# Altium project steering_wheel_unit.PrjPcb (part 2 of 2)

## Sheet io.SchDoc
size A2; SheetNumber: 2; SheetTotal: 4
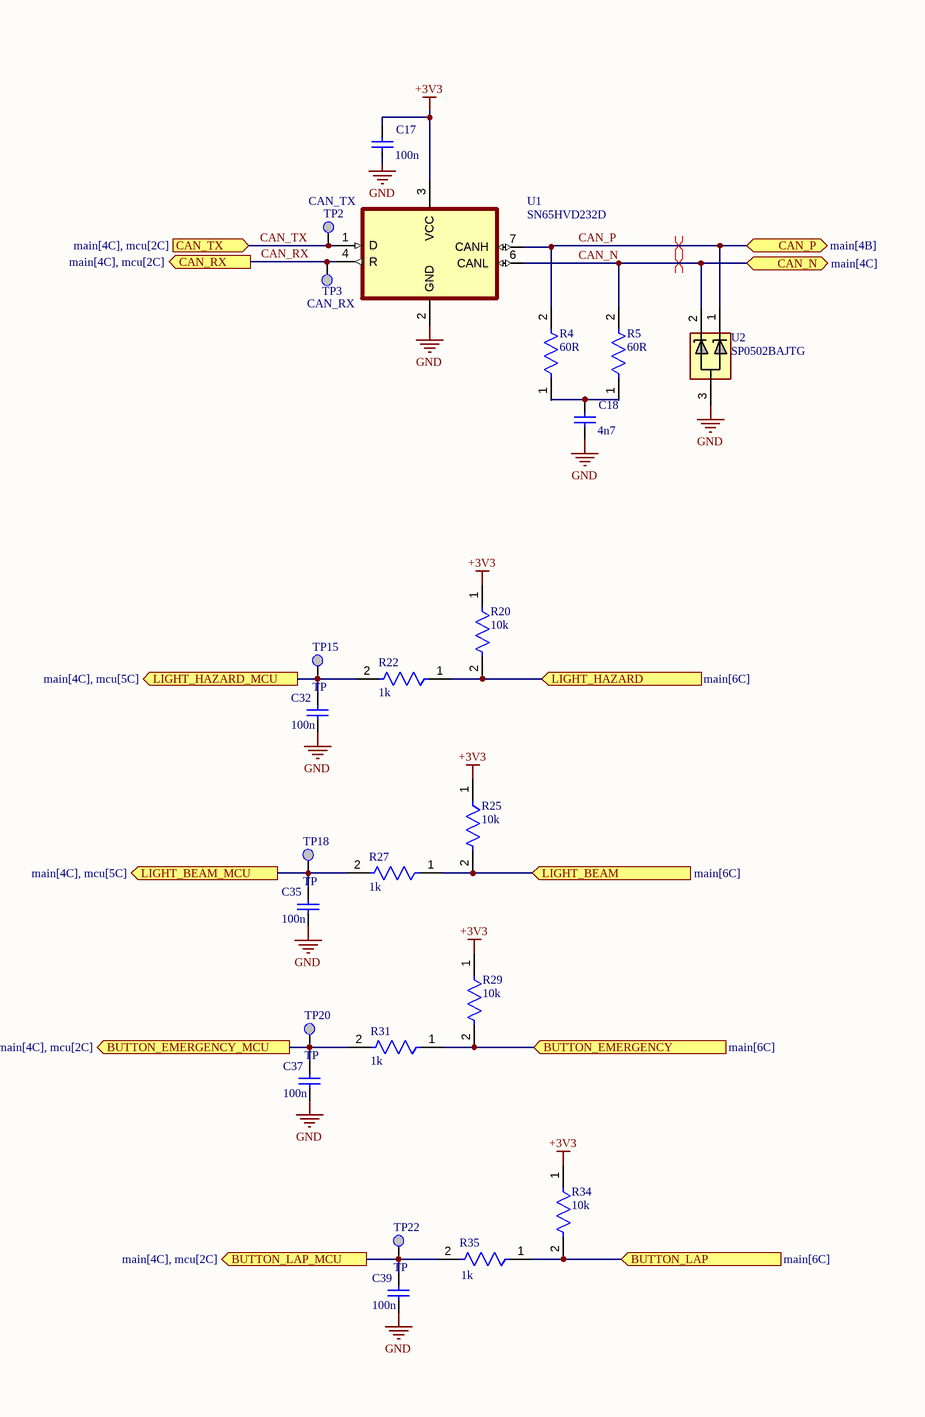
[diagram p2: io.SchDoc, left]
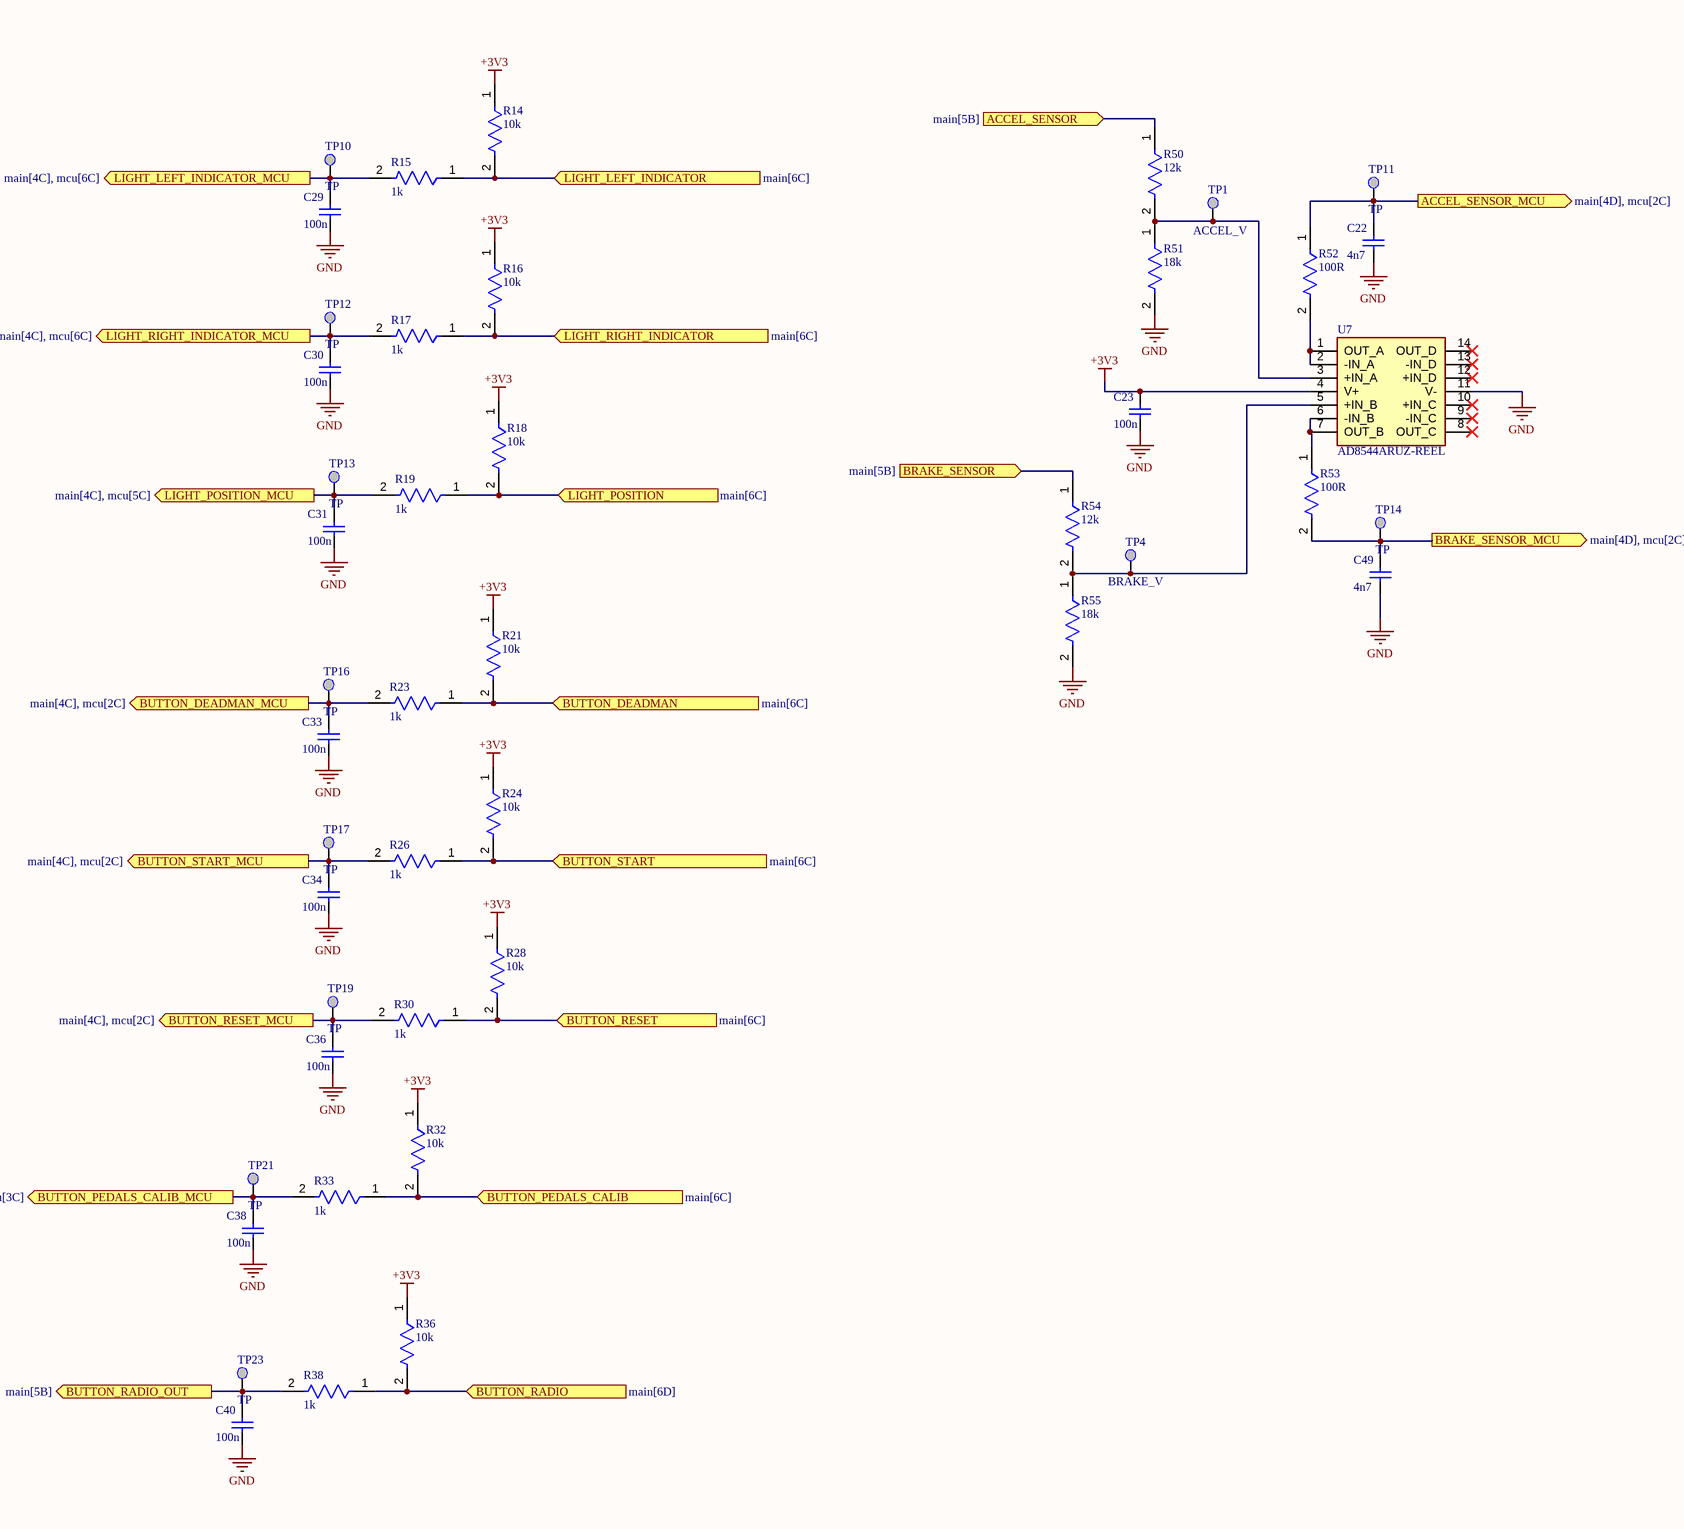
[diagram p3: io.SchDoc, right]

### Parts
C17  100n  [CAPC1206(3216)150_L]
C18  4n7  [CAPC1206(3216)150_L]
C22  4n7  [CAPC1206(3216)150_L]
C23  100n  [CAPC1206(3216)150_L]
C29  100n  [CAPC1206(3216)150_L]
C30  100n  [CAPC1206(3216)150_L]
C31  100n  [CAPC1206(3216)150_L]
C32  100n  [CAPC1206(3216)150_L]
C33  100n  [CAPC1206(3216)150_L]
C34  100n  [CAPC1206(3216)150_L]
C35  100n  [CAPC1206(3216)150_L]
C36  100n  [CAPC1206(3216)150_L]
C37  100n  [CAPC1206(3216)150_L]
C38  100n  [CAPC1206(3216)150_L]
C39  100n  [CAPC1206(3216)150_L]
C40  100n  [CAPC1206(3216)150_L]
C49  4n7  [CAPC1206(3216)150_L]
R4  60R  [FP-RK73H2B-MFG]
R5  60R  [FP-RK73H2B-MFG]
R14  10k  [FP-RK73H2B-MFG]
R15  1k  [FP-RK73H2B-MFG]
R16  10k  [FP-RK73H2B-MFG]
R17  1k  [FP-RK73H2B-MFG]
R18  10k  [FP-RK73H2B-MFG]
R19  1k  [FP-RK73H2B-MFG]
R20  10k  [FP-RK73H2B-MFG]
R21  10k  [FP-RK73H2B-MFG]
R22  1k  [FP-RK73H2B-MFG]
R23  1k  [FP-RK73H2B-MFG]
R24  10k  [FP-RK73H2B-MFG]
R25  10k  [FP-RK73H2B-MFG]
R26  1k  [FP-RK73H2B-MFG]
R27  1k  [FP-RK73H2B-MFG]
R28  10k  [FP-RK73H2B-MFG]
R29  10k  [FP-RK73H2B-MFG]
R30  1k  [FP-RK73H2B-MFG]
R31  1k  [FP-RK73H2B-MFG]
R32  10k  [FP-RK73H2B-MFG]
R33  1k  [FP-RK73H2B-MFG]
R34  10k  [FP-RK73H2B-MFG]
R35  1k  [FP-RK73H2B-MFG]
R36  10k  [FP-RK73H2B-MFG]
R38  1k  [FP-RK73H2B-MFG]
R50  12k  [FP-RK73H2B-MFG]
R51  18k  [FP-RK73H2B-MFG]
R52  100R  [FP-RK73H2B-MFG]
R53  100R  [FP-RK73H2B-MFG]
R54  12k  [FP-RK73H2B-MFG]
R55  18k  [FP-RK73H2B-MFG]
TP1  ACCEL_V  [Test_Point]
TP2  CAN_TX  [Test_Point]
TP3  CAN_RX  [Test_Point]
TP4  BRAKE_V  [Test_Point]
TP10  TP  [Test_Point]
TP11  TP  [Test_Point]
TP12  TP  [Test_Point]
TP13  TP  [Test_Point]
TP14  TP  [Test_Point]
TP15  TP  [Test_Point]
TP16  TP  [Test_Point]
TP17  TP  [Test_Point]
TP18  TP  [Test_Point]
TP19  TP  [Test_Point]
TP20  TP  [Test_Point]
TP21  TP  [Test_Point]
TP22  TP  [Test_Point]
TP23  TP  [Test_Point]
U1  SN65HVD232D  [SN65HVD232D]
U2  SP0502BAJTG  [SOT132P220X110-3N]
U7  AD8544ARUZ-REEL  [AD8544ARUZ-REEL]

### Ports
ACCEL_SENSOR (in, see main[5B]), ACCEL_SENSOR_MCU (out, see main[4D], mcu[2C]), BRAKE_SENSOR (in, see main[5B]), BRAKE_SENSOR_MCU (out, see main[4D], mcu[2C]), BUTTON_DEADMAN (in, see main[6C]), BUTTON_DEADMAN_MCU (out, see main[4C], mcu[2C]), BUTTON_EMERGENCY (in, see main[6C]), BUTTON_EMERGENCY_MCU (out, see main[4C], mcu[2C]), BUTTON_LAP (in, see main[6C]), BUTTON_LAP_MCU (out, see main[4C], mcu[2C]), BUTTON_PEDALS_CALIB (in, see main[6C]), BUTTON_PEDALS_CALIB_MCU (out, see main[4C], mcu[3C]), BUTTON_RADIO (in, see main[6D]), BUTTON_RADIO_OUT (out, see main[5B]), BUTTON_RESET (in, see main[6C]), BUTTON_RESET_MCU (out, see main[4C], mcu[2C]), BUTTON_START (in, see main[6C]), BUTTON_START_MCU (out, see main[4C], mcu[2C]), CAN_N (bidir, see main[4C]), CAN_P (bidir, see main[4B]), CAN_RX (out, see main[4C], mcu[2C]), CAN_TX (in, see main[4C], mcu[2C]), LIGHT_BEAM (in, see main[6C]), LIGHT_BEAM_MCU (out, see main[4C], mcu[5C]), LIGHT_HAZARD (in, see main[6C]), LIGHT_HAZARD_MCU (out, see main[4C], mcu[5C]), LIGHT_LEFT_INDICATOR (in, see main[6C]), LIGHT_LEFT_INDICATOR_MCU (out, see main[4C], mcu[6C]), LIGHT_POSITION (in, see main[6C]), LIGHT_POSITION_MCU (out, see main[4C], mcu[5C]), LIGHT_RIGHT_INDICATOR (in, see main[6C]), LIGHT_RIGHT_INDICATOR_MCU (out, see main[4C], mcu[6C])

### Nets
+3V3: C17.1 C23.1 R14.1 R16.1 R18.1 R20.1 R21.1 R24.1 R25.1 R28.1 R29.1 R32.1 R34.1 R36.1 U1.3(VCC) U7.4(V+)
GND: C17.2 C18.2 C22.2 C23.2 C29.2 C30.2 C31.2 C32.2 C33.2 C34.2 C35.2 C36.2 C37.2 C38.2 C39.2 C40.2 C49.2 R51.2 R55.2 U1.2(GND) U2.3 U7.11(V-)
ACCEL_SENSOR: R50.1 ; port ACCEL_SENSOR
ACCEL_SENSOR_MCU: C22.1 R52.1 TP11.1 ; port ACCEL_SENSOR_MCU
BRAKE_SENSOR: R54.1 ; port BRAKE_SENSOR
BRAKE_SENSOR_MCU: C49.1 R53.2 TP14.1 ; port BRAKE_SENSOR_MCU
BUTTON_DEADMAN: R21.2 R23.1 ; port BUTTON_DEADMAN
BUTTON_DEADMAN_MCU: C33.1 R23.2 TP16.1 ; port BUTTON_DEADMAN_MCU
BUTTON_EMERGENCY: R29.2 R31.1 ; port BUTTON_EMERGENCY
BUTTON_EMERGENCY_MCU: C37.1 R31.2 TP20.1 ; port BUTTON_EMERGENCY_MCU
BUTTON_LAP: R34.2 R35.1 ; port BUTTON_LAP
BUTTON_LAP_MCU: C39.1 R35.2 TP22.1 ; port BUTTON_LAP_MCU
BUTTON_PEDALS_CALIB: R32.2 R33.1 ; port BUTTON_PEDALS_CALIB
BUTTON_PEDALS_CALIB_MCU: C38.1 R33.2 TP21.1 ; port BUTTON_PEDALS_CALIB_MCU
BUTTON_RADIO: R36.2 R38.1 ; port BUTTON_RADIO
BUTTON_RADIO_OUT: C40.1 R38.2 TP23.1 ; port BUTTON_RADIO_OUT
BUTTON_RESET: R28.2 R30.1 ; port BUTTON_RESET
BUTTON_RESET_MCU: C36.1 R30.2 TP19.1 ; port BUTTON_RESET_MCU
BUTTON_START: R24.2 R26.1 ; port BUTTON_START
BUTTON_START_MCU: C34.1 R26.2 TP17.1 ; port BUTTON_START_MCU
CAN_N: R5.2 U1.6(CANL) U2.2 ; port CAN_N
CAN_P: R4.2 U1.7(CANH) U2.1 ; port CAN_P
CAN_RX: TP3.1 U1.4(R) ; port CAN_RX
CAN_TX: TP2.1 U1.1(D) ; port CAN_TX
LIGHT_BEAM: R25.2 R27.1 ; port LIGHT_BEAM
LIGHT_BEAM_MCU: C35.1 R27.2 TP18.1 ; port LIGHT_BEAM_MCU
LIGHT_HAZARD: R20.2 R22.1 ; port LIGHT_HAZARD
LIGHT_HAZARD_MCU: C32.1 R22.2 TP15.1 ; port LIGHT_HAZARD_MCU
LIGHT_LEFT_INDICATOR: R14.2 R15.1 ; port LIGHT_LEFT_INDICATOR
LIGHT_LEFT_INDICATOR_MCU: C29.1 R15.2 TP10.1 ; port LIGHT_LEFT_INDICATOR_MCU
LIGHT_POSITION: R18.2 R19.1 ; port LIGHT_POSITION
LIGHT_POSITION_MCU: C31.1 R19.2 TP13.1 ; port LIGHT_POSITION_MCU
LIGHT_RIGHT_INDICATOR: R16.2 R17.1 ; port LIGHT_RIGHT_INDICATOR
LIGHT_RIGHT_INDICATOR_MCU: C30.1 R17.2 TP12.1 ; port LIGHT_RIGHT_INDICATOR_MCU
NetC18_1: C18.1 R4.1 R5.1
NetR50_2: R50.2 R51.1 TP1.1 U7.3(+IN_A)
NetR52_2: R52.2 U7.1(OUT_A) U7.2(-IN_A)
NetR53_1: R53.1 U7.6(-IN_B) U7.7(OUT_B)
NetR54_2: R54.2 R55.1 TP4.1 U7.5(+IN_B)

Not connected (* = marked no-connect by the designer): U7 8(OUT_C)* 9(-IN_C)* 10(+IN_C)* 12(+IN_D)* 13(-IN_D)* 14(OUT_D)*

### Layout directives
differential pair: CAN_N, CAN_P

### Notes on the sheet
- DWG. NO.
- REV.
- SHT.
- REVISION
- DESCRIPTION
- DATE
- APPROVED
- THIS DOCUMENT AND THE DATA DISCLOSED HEREIN OR HEREWITH IS THE PROPERTY OF ALTIUM LIMITED AND MAY BE FREELY DISTRIBUTED IN WHOLE. NO RIGHTS ARE RESERVED OR EXPRESS OR IMPLIED WARANTEE GIVEN.
- ENG:
- DSN:
- APPROVALS
- PROJECT
- DOCUMENT REVISION:
- DESIGN ITEM:
- CHK:
- BOM:
- REFERENCE DOCUMENTS
- PROJECT REVISION:
- TITLE
- FAB DWG:
- PCB DWG:
- ASSY DWG:
- SCALE:
- SIZE
- C
- CAGE CODE
- FILE NAME
- DWG NO.
- SHEET
- OF
- REV

### Library data of the parts
C17 C18 C22 C23 C29-C40 C49 = CMP-1037-04778-1: CAP 1.8uF 10V ±5% 1206 (3216 Metric) Thickness 1.45mm SMD; Case-EIA: 1206; Tolerance: Â±5%; Case-Metric: 3216; Technology: SMT; Value: 1.8uF; Rated Voltage: 10 V; Max Thickness: 1.45 mm
R4 R5 R14-R36 R38 R50-R55 = CMP-04015-098385-1: 40.2kΩ ±1% 0.25W Chip Resistor 1206 Thick Film AEC-Q200 Qualified; Resistance: 40.2kR; Voltage Rating (DC): 200V; Temperature Coefficient: 100ppm/°C; Power Rating: 250mW; Tolerance: 1%; Package Quantity: 5000; Length: 3.2mm; Termination: SMD/SMT; Lead Free: Contains Lead; Case Code (Imperial): 1206; Case/Package: 1206; Voltage Rating: 200V; Case Code (Metric): 3216; Max Operating Temperature: 155°C; Packaging: Tape and Reel; Width: 1.6mm; Series: RK73H; Min Operating Temperature: -55°C; RoHS Compliant: No; Height: 0.6mm
TP1-TP4 TP10-TP23 = TestPoint
U1 = SN65HVD232D: Texas Instruments - SN65HVD232DR - Can Transceiver, 1MBPS, 1/1, 3.3V, SOIC-8, Full Reel; Manufacturer Lifecycle Status: ACTIVE; Max Supply Voltage: 3.6V; Min Supply Voltage: 3V; Nominal Supply Current: 17mA; Number of Drivers: 1; SnapEDA_Link: https://www.snapeda.com/parts/SN65HVD232D/Texas+Instruments/view-part/?ref=snap; Package: SOIC-8 Texas Instruments; Value: *; MF: Texas Instruments; MP: SN65HVD232D; Check_prices: https://www.snapeda.com/parts/SN65HVD232D/Texas+Instruments/view-part/?ref=eda; Supplier: Arrow Electronics; Supplier Part Number: SN65HVD232DR; Manufacturer: Texas Instruments; Manufacturer Part Number: SN65HVD232DR; RoHS: Compliant; Category: CAN Transceivers; Stock: 10000; Pricing: 2500=1,1159, 5000=1,076, 7500=1,062 (USD); Case/Package: SOIC; Data Rate: 1Mbps; Height: 1.75mm; Lead Free: Lead Free; Length: 4.9mm; Lifecycle Status: Production; Max Operating Temperature: 85°C; Min Operating Temperature: -40°C; Pins: 8; Number of Receive Buffers: 1; Number of Receivers: 1; Number of Transceivers: 1; Number of Transmit Buffers: 1; Packaging: Cut Tape; Radiation Hardening: No; REACH SVHC: No; Schedule B: 8542390000, 8542390000|8542390000|8542390000|8542390000|8542390000; Thickness: 1.58mm; Weight: 72.603129mg; Width: 3.91mm; ComponentLink1URL: https://octopart.com:443/opatz8j6/c1?t=KNMFt9M64p-_id6rZ0-P1CX6CGmvk_NFg0bt7DHXbi_P10EFF0MZE_9gM8ERckOxIywTBgDrXd4Bw1XwEAcVVdK92p9CEfdSNaVajf6_bxnez3EeN1RE1wZBaojbXTwQ_101S7Bb856c3hUAWErS0_zGIM1B6Z6dFQwv_Ps2SUdVVUCjmJkLnMLZKTBWfnIVcgJIheW78JYanUyW_1u-I93chBuiSPXQYIk2xXb9JgOyrE9lHEnesRSQq9luJOd1yknyGQP0N3Is0_dGM9QrGV5UOgjoada9tMnQwKJP8gahr3iTK59XJFH6OfbHTOm3R9BdESCrBMbrE2MVOGPPkVOTrqf0YMovDpmf-konbncFnSES8CNOhHqMwHv2HEwKcPoK44nl&src-supplier=Texas+Instruments; ComponentLink1Description: https://octopart.com:443/opatz8j6/c1?t=KNMFt9M64p-_id6rZ0-P1CX6CGmvk_NFg0bt7DHXbi_P10EFF0MZE_9gM8ERckOxIywTBgDrXd4Bw1XwEAcVVdK92p9CEfdSNaVajf6_bxnez3EeN1RE1wZBaojbXTwQ_101S7Bb856c3hUAWErS0_zGIM1B6Z6dFQwv_Ps2SUdVVUCjmJkLnMLZKTBWfnIVcgJIheW78JYanUyW_1u-I93chBuiSPXQYIk2xXb9JgOyrE9lHEnesRSQq9luJOd1yknyGQP0N3Is0_dGM9QrGV5UOgjoada9tMnQwKJP8gahr3iTK59XJFH6OfbHTOm3R9BdESCrBMbrE2MVOGPPkVOTrqf0YMovDpmf-konbncFnSES8CNOhHqMwHv2HEwKcPoK44nl&src-supplier=Texas+Instruments; ComponentLink2URL: https://sigma.octopart.com:443/49249642/technical_drawing/Texas-Instruments-SN65HVD232DR.pdf?src-supplier=Texas+Instruments; ComponentLink2Description: https://sigma.octopart.com:443/49249642/technical_drawing/Texas-Instruments-SN65HVD232DR.pdf?src-supplier=Texas+Instruments; ComponentLink3URL: https://datasheet.octopart.com:443/SN65HVD232DR-Texas-Instruments-datasheet-81447765.pdf?src-supplier=Upverter; ComponentLink3Description: https://datasheet.octopart.com:443/SN65HVD232DR-Texas-Instruments-datasheet-81447765.pdf?src-supplier=Upverter; ComponentLink4URL: https://datasheet.octopart.com:443/SN65HVD232DR-Texas-Instruments-datasheet-37140773.pdf?src-supplier=Newark; ComponentLink4Description: https://datasheet.octopart.com:443/SN65HVD232DR-Texas-Instruments-datasheet-37140773.pdf?src-supplier=Newark; ComponentLink5URL: https://datasheet.octopart.com:443/SN65HVD232DR-Texas-Instruments-datasheet-14436966.pdf?src-supplier=Newark; ComponentLink5Description: https://datasheet.octopart.com:443/SN65HVD232DR-Texas-Instruments-datasheet-14436966.pdf?src-supplier=Newark; ComponentLink6URL: https://datasheet.octopart.com:443/SN65HVD232DR-Texas-Instruments-datasheet-58296547.pdf?src-supplier=Newark; ComponentLink6Description: https://datasheet.octopart.com:443/SN65HVD232DR-Texas-Instruments-datasheet-58296547.pdf?src-supplier=Newark; ComponentLink7URL: https://datasheet.octopart.com:443/SN65HVD232DR-Texas-Instruments-datasheet-48117850.pdf?src-supplier=Newark; ComponentLink7Description: https://datasheet.octopart.com:443/SN65HVD232DR-Texas-Instruments-datasheet-48117850.pdf?src-supplier=Newark; ComponentLink8URL: https://datasheet.octopart.com:443/SN65HVD232DR-Texas-Instruments-datasheet-10256024.pdf?src-supplier=Arrow+Electronics; ComponentLink8Description: https://datasheet.octopart.com:443/SN65HVD232DR-Texas-Instruments-datasheet-10256024.pdf?src-supplier=Arrow+Electronics; ComponentLink9URL: https://datasheet.octopart.com:443/SN65HVD232DR-Texas-Instruments-datasheet-149765.pdf?src-supplier=Mouser; ComponentLink9Description: https://datasheet.octopart.com:443/SN65HVD232DR-Texas-Instruments-datasheet-149765.pdf?src-supplier=Mouser; ComponentLink10URL: https://datasheet.octopart.com:443/SN65HVD232DR-Texas-Instruments-datasheet-62292544.pdf?src-supplier=Farnell; ComponentLink10Description: https://datasheet.octopart.com:443/SN65HVD232DR-Texas-Instruments-datasheet-62292544.pdf?src-supplier=Farnell; ComponentLink11URL: https://datasheet.octopart.com:443/SN65HVD232DR-Texas-Instruments-datasheet-164416263.pdf?src-supplier=SHENGYU+ELECTRONICS; ComponentLink11Description: https://datasheet.octopart.com:443/SN65HVD232DR-Texas-Instruments-datasheet-164416263.pdf?src-supplier=SHENGYU+ELECTRONICS; ComponentLink12URL: https://datasheet.octopart.com:443/SN65HVD232DR-Texas-Instruments-datasheet-159115712.pdf?src-supplier=LCSC; ComponentLink12Description: https://datasheet.octopart.com:443/SN65HVD232DR-Texas-Instruments-datasheet-159115712.pdf?src-supplier=LCSC; ComponentLink13URL: https://datasheet.octopart.com:443/SN65HVD232DR-Texas-Instruments-datasheet-137316104.pdf?src-supplier=Future+Electronics; ComponentLink13Description: https://datasheet.octopart.com:443/SN65HVD232DR-Texas-Instruments-datasheet-137316104.pdf?src-supplier=Future+Electronics; ComponentLink14URL: https://datasheet.octopart.com:443/SN65HVD232DR-Texas-Instruments-datasheet-8625468.pdf?src-supplier=Verical; ComponentLink14Description: https://datasheet.octopart.com:443/SN65HVD232DR-Texas-Instruments-datasheet-8625468.pdf?src-supplier=Verical; ComponentLink15URL: https://datasheet.octopart.com:443/SN65HVD232DR-Texas-Instruments-datasheet-8378736.pdf?src-supplier=Verical; ComponentLink15Description: https://datasheet.octopart.com:443/SN65HVD232DR-Texas-Instruments-datasheet-8378736.pdf?src-supplier=Verical; ComponentLink16URL: http://sigma.octopart.com:80/conflict_mineral_statement/Texas-Instruments-company-63.pdf?src-supplier=Compliance+Statements; ComponentLink16Description: http://sigma.octopart.com:80/conflict_mineral_statement/Texas-Instruments-company-63.pdf?src-supplier=Compliance+Statements; ComponentLink17URL: http://sigma.octopart.com:80/reach_statement/Texas-Instruments-company-64.pdf?src-supplier=Compliance+Statements; ComponentLink17Description: http://sigma.octopart.com:80/reach_statement/Texas-Instruments-company-64.pdf?src-supplier=Compliance+Statements
U2 = SP0502BAJTG: Integrated Circuit; Manufacturer_Name: LITTELFUSE; Datasheet Link: https://www.littelfuse.com/~/media/electronics/datasheets/tvs_diode_arrays/littelfuse_tvs_diode_array_sp05_datasheet.pdf.pdf; Height: 1.1mm; Manufacturer_Part_Number: SP0502BAJTG; Mouser Part Number: 576-SP0502BAJTG; Mouser Price/Stock: https://www.mouser.co.uk/ProductDetail/Littelfuse/SP0502BAJTG?qs=RnOBYWd%2Fz7cttN1Mwg4HWA%3D%3D; Arrow Part Number: SP0502BAJTG; Arrow Price/Stock: https://www.arrow.com/en/products/sp0502bajtg/littelfuse?region=nac
U7 = AD8544ARUZ-REEL: Single-supply operation: 2.7 V to 5.5 V  Low supply current: 45 A/amplifier  Wide bandwidth: 1 MHz  No phase reversal  Low input currents: 4 pA  Unity gain stable  Rail-to-rail input and output  AEC-Q100 qualified for automotive applications; Manufacturer_Name: Analog Devices; Geometry.Height: 1.2mm; Manufacturer_Part_Number: AD8544ARUZ-REEL; Mouser Part Number: 584-AD8544ARUZ-R; Mouser Price/Stock: https://www.mouser.co.uk/ProductDetail/Analog-Devices/AD8544ARUZ-REEL?qs=%2FtpEQrCGXCzshxYletFRHw%3D%3D; Arrow Part Number: AD8544ARUZ-REEL; Arrow Price/Stock: https://www.arrow.com/en/products/ad8544aruz-reel/analog-devices; Datasheet Link: https://www.analog.com/AD8544/datasheet

## Sheet power.SchDoc
size A4; SheetNumber: 3; SheetTotal: 4
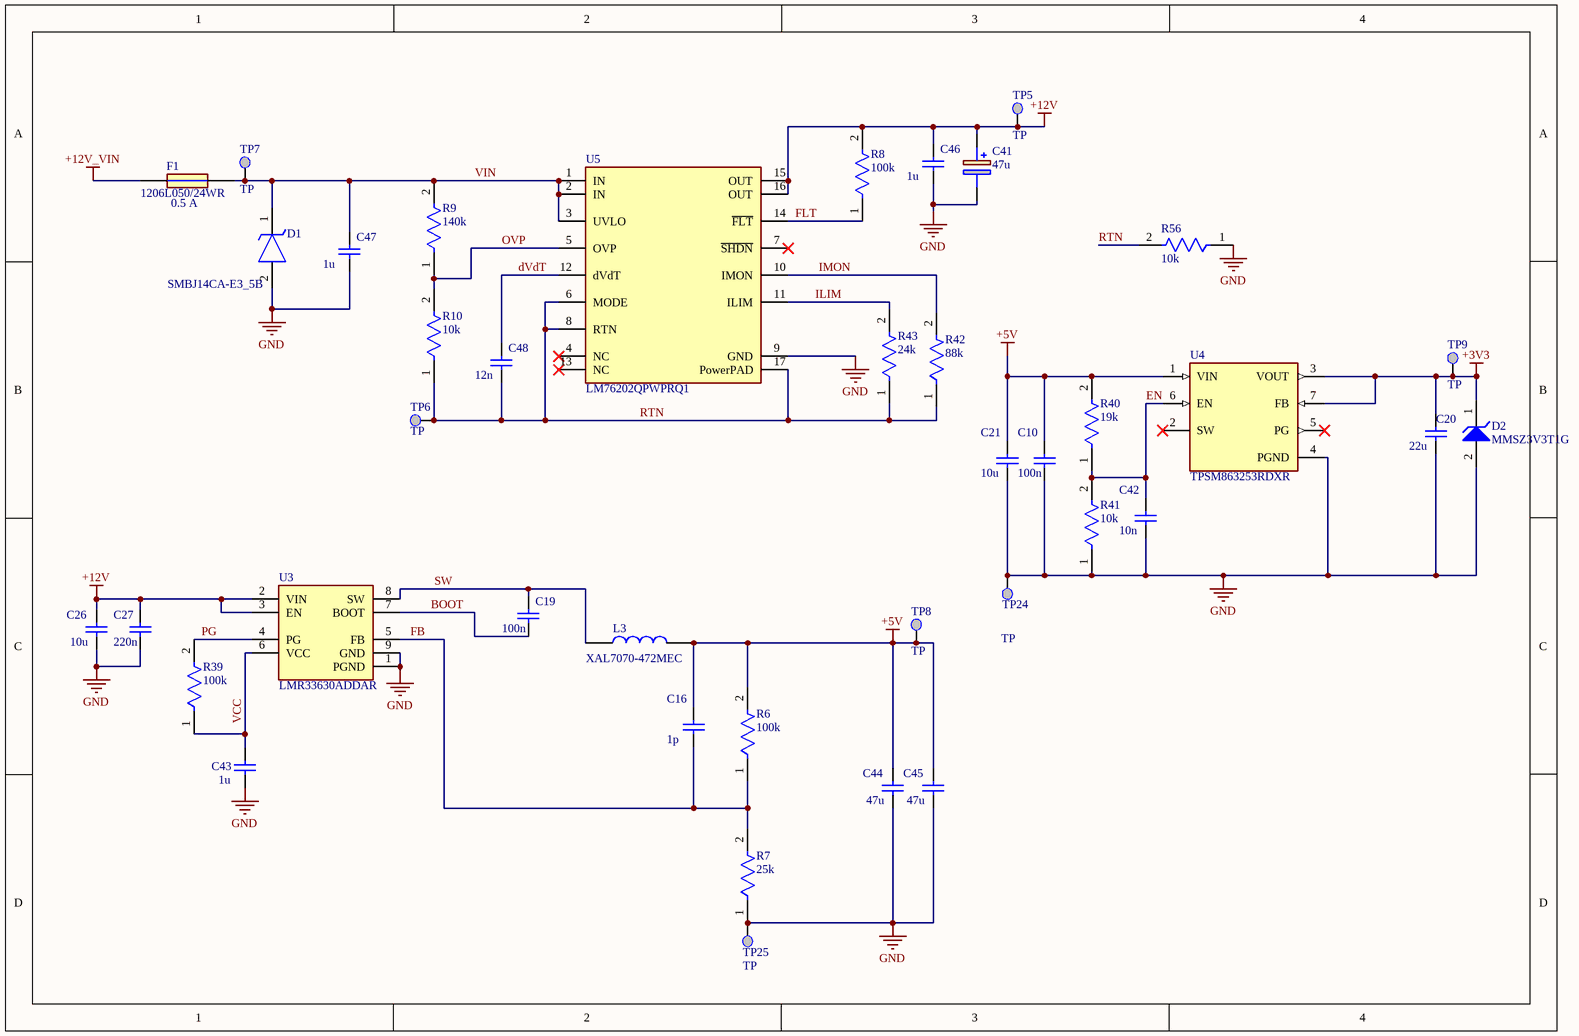
[diagram p4: power.SchDoc]

### Parts
C10  100n  [CAPC1206(3216)150_L]
C16  1p  [CAPC1206(3216)150_L]
C19  100n  [CAPC1206(3216)150_L]
C20  22u  [CAPC1206(3216)150_L]
C21  10u  [CAPC1206(3216)150_L]
C26  10u  [CAPC1206(3216)150_L]
C27  220n  [CAPC1206(3216)150_L]
C41  47u  [EDK476M035S9GAA]
C42  10n  [CAPC1206(3216)150_L]
C43  1u  [CAPC1206(3216)150_L]
C44  47u  [CAPC1206(3216)150_L]
C45  47u  [CAPC1206(3216)150_L]
C46  1u  [CAPC1206(3216)150_L]
C47  1u  [CAPC1206(3216)150_L]
C48  12n  [CAPC1206(3216)150_L]
D1  SMBJ14CA-E3_5B  [SMBJ13A-E3_5B]
D2  MMSZ3V3T1G  [ONSC-SOD-123-2-425-04_V]
F1  1206L050/24WR  [0ZCJ0025FF2E]
L3  XAL7070-472MEC  [XAL7070472MEC]
R6  100k  [FP-RK73H2B-MFG]
R7  25k  [FP-RK73H2B-MFG]
R8  100k  [FP-RK73H2B-MFG]
R9  140k  [FP-RK73H2B-MFG]
R10  10k  [FP-RK73H2B-MFG]
R39  100k  [FP-RK73H2B-MFG]
R40  19k  [FP-RK73H2B-MFG]
R41  10k  [FP-RK73H2B-MFG]
R42  88k  [FP-RK73H2B-MFG]
R43  24k  [FP-RK73H2B-MFG]
R56  10k  [FP-RK73H2B-MFG]
TP5  TP  [Test_Point]
TP6  TP  [Test_Point]
TP7  TP  [Test_Point]
TP8  TP  [Test_Point]
TP9  TP  [Test_Point]
TP24  TP  [Test_Point]
TP25  TP  [Test_Point]
U3  LMR33630ADDAR  [LMR33630ADDAR]
U4  TPSM863253RDXR  [TPSM863253RDXR]
U5  LM76202QPWPRQ1  [FP-PWP0016H-MFG]

### Nets
+3V3: C20.1 D2.1(K) TP9.1 U4.3(VOUT) U4.7(FB)
+5V: C10.1 C16.1 C21.1 C44.1 C45.1 L3.2 R6.2 R40.2 TP8.1 U4.1(VIN)
+12V: C26.1 C27.1 C41.1(+) C46.1 R8.2 TP5.1 U3.2(VIN) U3.3(EN) U5.15(OUT) U5.16(OUT)
+12V_VIN: F1.1
GND: C10.2 C20.2 C21.2 C26.2 C27.2 C41.2(-) C42.2 C43.2 C44.2 C45.2 C46.2 C47.2 D1.2(A) D2.2(A) R7.1 R41.1 R56.1 TP24.1 TP25.1 U3.1(PGND) U3.9(GND) U4.4(PGND) U5.9(GND)
BOOT: C19.2 U3.7(BOOT)
dVdT: C48.1 U5.12(dVdT)
EN: C42.1 R40.1 R41.2 U4.6(EN)
FB: C16.2 R6.1 R7.2 U3.5(FB)
FLT: R8.1 U5.14(~{FLT})
ILIM: R43.2 U5.11(ILIM)
IMON: R42.2 U5.10(IMON)
OVP: R9.1 R10.2 U5.5(OVP)
PG: R39.2 U3.4(PG)
RTN: C48.2 R10.1 R42.1 R43.1 R56.2 TP6.1 U5.6(MODE) U5.8(RTN) U5.17(PowerPAD)
SW: C19.1 L3.1 U3.8(SW)
VCC: C43.1 R39.1 U3.6(VCC)
VIN: C47.1 D1.1(K) F1.2 R9.2 TP7.1 U5.1(IN) U5.2(IN) U5.3(UVLO)

Not connected (* = marked no-connect by the designer): U4 2(SW)* 5(PG)*; U5 4(NC)* 7(~{SHDN})* 13(NC)*

### Notes on the sheet
- (near F1) 0.5 A

### Library data of the parts
C10 C16 C19-C21 C26 C27 C42-C48 = CMP-1037-04778-1: as C17 on sheet io; Technology: SMT; Value: 1.8uF; Rated Voltage: 10 V; Max Thickness: 1.45 mm
C41 = EDK476M035S9GAA: Surface Mount, Aluminum Electrolytic; Manufacturer_Name: Yageo Group; Geometry.Height: 5.65mm; Manufacturer_Part_Number: EDK476M035S9GAA; Mouser Part Number: 80-EDK476M035S9GAA; Mouser Price/Stock: https://www.mouser.co.uk/ProductDetail/KEMET/EDK476M035S9GAA?qs=T9vdlufmP8xkQWuUhcj0Kg%3D%3D; Arrow Part Number: EDK476M035S9GAA; Arrow Price/Stock: https://www.arrow.com/en/products/edk476m035s9gaa/kemet-corporation?utm_currency=USD&region=nac; Datasheet Link: https://www.yageogroup.com/content/datasheet/asset/file/KEM_A4001_EDK
D1 = SMBJ13A-E3_5B: TVS Diode (Uni-directional); Manufacturer_Name: Vishay; Manufacturer_Part_Number: SMBJ13A-E3/5B; Datasheet Link: http://www.vishay.com/docs/88392/smbj.pdf; Height: 2.44mm; Mouser Part Number: 625-SMBJ13A-E3/5B; Mouser Price/Stock: https://www.mouser.co.uk/ProductDetail/Vishay-General-Semiconductor/SMBJ13A-E3-5B?qs=3qLEwsAJF5SlimqtZxBirg%3D%3D; Arrow Part Number: SMBJ13A-E3/5B; Arrow Price/Stock: https://www.arrow.com/en/products/smbj13a-e35b/vishay?utm_currency=USD&region=europe
D2 = CMP-1060-00515-1: Zener Voltage Regulator, 500 mW, 2-Pin SOD-123, Pb-Free, Tape and Reel; Manufacturer: On Semiconductor; P Max (W): 0.5; ComponentLink3URL: http://www.onsemi.com/pub_link/Collateral/425-04.PDF; ComponentLink2Description: Datasheet; DatasheetVersion: Rev. 11; ComponentLink1URL: http://www.onsemi.com/; PackageDescription: 2-Pin SOD, Body 1.6 x 2.69 mm; Mounting Technology: Surface Mount; ComponentLink3Description: Package Specification; ComponentLink1Description: Manufacturer URL; Packing: Tape and Reel; ComponentLink2URL: http://www.onsemi.com/pub_link/Collateral/MMSZ2V4T1-D.PDF; PartNumber: MMSZ3V3T1G; PackageReference: SOD-123-2-425-04; PackageVersion: Rev. G, 10/2009; RoHS: Pb-Free
F1 = 0ZCJ0025FF2E: BEL FUSE - CIRCUIT PROTECTION - 0ZCJ0025FF2E - FUSE, RESETTABLE PTC, 16VDC, 0.25A, SMD; Manufacturer_Name: Bel Circuit Protection; Geometry.Height: 0.75mm; Mouser Part Number: *; Mouser Price/Stock: *; Manufacturer_Part_Number: 0ZCJ0025FF2E; Datasheet Link: https://componentsearchengine.com/Datasheets/2/0ZCJ0025FF2E.pdf
L3 = XAL7070-472MEC: General Purpose Inductor, 4.7uH, 20%, 1 Element, Composite-Core, SMD, 3028; Manufacturer_Name: COILCRAFT; Geometry.Height: 7mm; DC Resistance (DCR): 14.26mΩ; Value: 4.7µH; Max Current Rating: 13.6A; Number of Circuits: 1; Saturation Current: 15.2A; Self Resonant Frequency: 26MHz; Shielding: Yes; Test Frequency: 1MHz; Mouser Part Number: 994-XAL7070-472MEC; Mouser Price/Stock: https://www.mouser.co.uk/ProductDetail/Coilcraft/XAL7070-472MEC?qs=zCSbvcPd3pZar3i%2F4%252BSjWg%3D%3D; Manufacturer_Part_Number: XAL7070-472MEC; Datasheet Link: https://www.coilcraft.com/pdfs/xal7070.pdf; Supplier: Farnell; Supplier Part Number: 2289129; Manufacturer: Coilcraft; Manufacturer Part Number: XAL7070-472MEC; RoHS: Compliant; Category: Fixed Inductors; Stock: 742; Ambient Temperature Range High: 125°C; Case/Package: SMD/SMT; Core Material: Composite; Height: 7mm; Inductance Tolerance: 20%; Lead Free: Contains Lead; Length: 8mm; Lifecycle Status: Production; Max DC Current: 13.6A; Max Operating Temperature: 125°C; Min Operating Temperature: -40°C; Mounting Technology: Surface Mount; Number of Terminals: 2; Packaging: Cut Tape; REACH SVHC: Yes; RMS Current (Irms): 13.6A; ESR: 14.26mΩ; Termination: SMD/SMT; Tolerance: 20%; Width: 7.2mm; ComponentLink1URL: https://datasheet.octopart.com:443/XAL7070-472MEC-Coilcraft-datasheet-180122068.pdf?src-supplier=IHS; ComponentLink1Description: https://datasheet.octopart.com:443/XAL7070-472MEC-Coilcraft-datasheet-180122068.pdf?src-supplier=IHS; ComponentLink2URL: https://datasheet.octopart.com:443/XAL7070-472MEC-Coilcraft-datasheet-10791984.pdf?src-supplier=Coilcraft+Direct; ComponentLink2Description: https://datasheet.octopart.com:443/XAL7070-472MEC-Coilcraft-datasheet-10791984.pdf?src-supplier=Coilcraft+Direct; ComponentLink3URL: https://datasheet.octopart.com:443/XAL7070-472MEC-Coilcraft-datasheet-181955335.pdf?src-supplier=Newark; ComponentLink3Description: https://datasheet.octopart.com:443/XAL7070-472MEC-Coilcraft-datasheet-181955335.pdf?src-supplier=Newark; ComponentLink4URL: https://datasheet.octopart.com:443/XAL7070-472MEC-Coilcraft-datasheet-14354386.pdf?src-supplier=Newark; ComponentLink4Description: https://datasheet.octopart.com:443/XAL7070-472MEC-Coilcraft-datasheet-14354386.pdf?src-supplier=Newark
R6-R10 R39-R43 R56 = CMP-04015-098385-1: as R4 on sheet io; Tolerance: 1%; Package Quantity: 5000; Length: 3.2mm; Termination: SMD/SMT; Lead Free: Contains Lead; Case Code (Imperial): 1206; Case/Package: 1206; Voltage Rating: 200V; Case Code (Metric): 3216; Max Operating Temperature: 155°C; Packaging: Tape and Reel; Width: 1.6mm; Series: RK73H; Min Operating Temperature: -55°C; RoHS Compliant: No; Height: 0.6mm
TP5-TP9 TP24 TP25 = TestPoint
U3 = LMR33630ADDAR: SIMPLE SWITCHER® 3.8V to 36V, 3A Synchronous Buck Converter With Ultra-Low EMI 8-SO PowerPAD -40 to 125; Manufacturer_Name: Texas Instruments; Manufacturer Lifecycle Status: ACTIVE; Geometry.Height: 1.7mm; Max Duty Cycle: 98%; Max Junction Temperature (Tj): 150°C; Nominal Supply Current: 24µA; Number of Channels: 1; Switching Frequency: 400kHz; Manufacturer_Part_Number: LMR33630ADDAR; Mouser Part Number: 595-LMR33630ADDAR; Mouser Price/Stock: https://www.mouser.co.uk/ProductDetail/Texas-Instruments/LMR33630ADDAR?qs=r5DSvlrkXmJQkBTqgVdiDA%3D%3D; Arrow Part Number: LMR33630ADDAR; Arrow Price/Stock: https://www.arrow.com/en/products/lmr33630addar/texas-instruments?utm_currency=USD&region=nac; Datasheet Link: http://www.ti.com/lit/gpn/lmr33630; Supplier: DigiKey; Supplier Part Number: 296-49763-1-ND; Manufacturer: Texas Instruments; Manufacturer Part Number: LMR33630ADDAR; RoHS: Compliant; Category: Voltage Regulators - Switching; Stock: 3306; Pricing: 1=2,55, 10=1,895, 25=1,732, 100=1,5527, 250=1,4672, 500=1,41566, 1000=1,37324 (USD); Height: 1.7mm; Length: 4.89mm; Lifecycle Status: Production; Max Operating Temperature: 125°C; Max Supply Voltage: 36V; Min Operating Temperature: -40°C; Min Supply Voltage: 3.8V; Number of Outputs: 1; Pins: 8; Output Current: 3A; Schedule B: 8542390000; Thickness: 1.48mm; Topology: Buck; Width: 3.9mm; ComponentLink1URL: https://octopart.com:443/opatz8j6/c1?t=vB-rOmDI1ErJ0w3fCj8NLsfgClszgTUVbAqCYHM5mRqgzR9RBB5Pla--LZzs2g-5lBj7oDBEHLOY0DNQ8kiPC6C8g1CaFcIk5xusZs0FtDRH-CQ1FAZX0wQ7Af0vopd1OvNJ_Hrieycu-9D8HxSeoZovH4OJEcn7j74SeItdt-lCJsWpQWgV8-mVR1JIQ1KywJKCZ68bDiAWG91PubKPct48upMq1AnCkLHjDL3bhpicF0q3kjtxBAWzeDQzkpoQooz9GAvObiI6PlzZfk112pcCDh0P81IWp_Rr5acb26OlKDk2j5b40au3vy2C1-LFGDaZycRESUfyv9lqHnr9FsK7A0AJECnAAloOYp_c-_g9Mk5jVvAjSOs1Y_7rtCi9vouLs8vl&src-supplier=Texas+Instruments; ComponentLink1Description: https://octopart.com:443/opatz8j6/c1?t=vB-rOmDI1ErJ0w3fCj8NLsfgClszgTUVbAqCYHM5mRqgzR9RBB5Pla--LZzs2g-5lBj7oDBEHLOY0DNQ8kiPC6C8g1CaFcIk5xusZs0FtDRH-CQ1FAZX0wQ7Af0vopd1OvNJ_Hrieycu-9D8HxSeoZovH4OJEcn7j74SeItdt-lCJsWpQWgV8-mVR1JIQ1KywJKCZ68bDiAWG91PubKPct48upMq1AnCkLHjDL3bhpicF0q3kjtxBAWzeDQzkpoQooz9GAvObiI6PlzZfk112pcCDh0P81IWp_Rr5acb26OlKDk2j5b40au3vy2C1-LFGDaZycRESUfyv9lqHnr9FsK7A0AJECnAAloOYp_c-_g9Mk5jVvAjSOs1Y_7rtCi9vouLs8vl&src-supplier=Texas+Instruments; ComponentLink2URL: https://sigma.octopart.com:443/104526336/technical_drawing/Texas-Instruments-LMR33630ADDAR.pdf?src-supplier=Texas+Instruments; ComponentLink2Description: https://sigma.octopart.com:443/104526336/technical_drawing/Texas-Instruments-LMR33630ADDAR.pdf?src-supplier=Texas+Instruments; ComponentLink3URL: https://sigma.octopart.com:443/49250132/technical_drawing/Texas-Instruments-LMR33630ADDAR.pdf?src-supplier=Texas+Instruments; ComponentLink3Description: https://sigma.octopart.com:443/49250132/technical_drawing/Texas-Instruments-LMR33630ADDAR.pdf?src-supplier=Texas+Instruments; ComponentLink4URL: https://datasheet.octopart.com:443/LMR33630ADDAR-Texas-Instruments-datasheet-148393519.pdf?src-supplier=Upverter; ComponentLink4Description: https://datasheet.octopart.com:443/LMR33630ADDAR-Texas-Instruments-datasheet-148393519.pdf?src-supplier=Upverter; ComponentLink5URL: https://datasheet.octopart.com:443/LMR33630ADDAR-Texas-Instruments-datasheet-163730535.pdf?src-supplier=LCSC; ComponentLink5Description: https://datasheet.octopart.com:443/LMR33630ADDAR-Texas-Instruments-datasheet-163730535.pdf?src-supplier=LCSC; ComponentLink6URL: http://sigma.octopart.com:80/reach_statement/Texas-Instruments-company-64.pdf?src-supplier=Compliance+Statements; ComponentLink6Description: http://sigma.octopart.com:80/reach_statement/Texas-Instruments-company-64.pdf?src-supplier=Compliance+Statements; ComponentLink7URL: http://sigma.octopart.com:80/conflict_mineral_statement/Texas-Instruments-company-63.pdf?src-supplier=Compliance+Statements; ComponentLink7Description: http://sigma.octopart.com:80/conflict_mineral_statement/Texas-Instruments-company-63.pdf?src-supplier=Compliance+Statements
U4 = TPSM863253RDXR: 3V to 17V input voltage, 3.3V, 3A output synchronous buck module in QFN package 7-QFN-FCMOD -40 to 125; Manufacturer Lifecycle Status: ACTIVE; MF: Texas Instruments; SnapEDA_Link: https://www.snapeda.com/parts/TPSM863253RDXR/Texas+Instruments/view-part/?ref=snap; Package: None; Value: *; MP: TPSM863253RDXR; Check_prices: https://www.snapeda.com/parts/TPSM863253RDXR/Texas+Instruments/view-part/?ref=eda; Supplier: DigiKey; Supplier Part Number: 296-TPSM863253RDXRCT-ND; Manufacturer: Texas Instruments; Manufacturer Part Number: TPSM863253RDXR; RoHS: Compliant; Category: Integrated Circuits (ICs); Stock: 3257; Pricing: 1=2,63, 10=1,96, 25=1,7924, 100=1,6078, 250=1,51976, 500=1,46668, 1000=1,42301 (USD); Height: 0m; Length: 4mm; Lifecycle Status: Production; Pins: 7; Thickness: 2mm; Width: 3.3mm; ComponentLink1URL: https://octopart.com:443/opatz8j6/c1?t=jS2VDNp59x-r3M4UnJwIkxDyXkbjHNSAoP2Fns5-Wk80kLlb-mQ5gVuk8zyi84j77RuBrZF-262aE3noOfDKcDGPEWkV9DoDQewFCLFFRyInceCxvVyAfhTYCYIywjkPWDqBy3YcbHQILjtWA_Eaj3WAHosXV5eHD7vpZYJjVrSO88bXdsuSYdlpSx9vUfFmQgFuFA-HMfKLGSBXL49TLOzJ5T2tngLQpQw-KF5iF-olhgVCegbBT0_kXe8-zNmOJ90ZL3AMoFtxFgWXTiA3kg8TbPVDzmO9NJcakYYdjuReFGLrhU-Lh8uurvImosMTR0LFVg6PaXdiPOKNUC1j5THOrz5of0wHKRbirvbX2rJGgWFTmZxbk0I20_VZT7Zu5rI_wToFdFWt&src-supplier=Texas+Instruments; ComponentLink1Description: https://octopart.com:443/opatz8j6/c1?t=jS2VDNp59x-r3M4UnJwIkxDyXkbjHNSAoP2Fns5-Wk80kLlb-mQ5gVuk8zyi84j77RuBrZF-262aE3noOfDKcDGPEWkV9DoDQewFCLFFRyInceCxvVyAfhTYCYIywjkPWDqBy3YcbHQILjtWA_Eaj3WAHosXV5eHD7vpZYJjVrSO88bXdsuSYdlpSx9vUfFmQgFuFA-HMfKLGSBXL49TLOzJ5T2tngLQpQw-KF5iF-olhgVCegbBT0_kXe8-zNmOJ90ZL3AMoFtxFgWXTiA3kg8TbPVDzmO9NJcakYYdjuReFGLrhU-Lh8uurvImosMTR0LFVg6PaXdiPOKNUC1j5THOrz5of0wHKRbirvbX2rJGgWFTmZxbk0I20_VZT7Zu5rI_wToFdFWt&src-supplier=Texas+Instruments; ComponentLink2URL: https://datasheet.octopart.com:443/TPSM863253RDXR-Texas-Instruments-datasheet-184174687.pdf?src-supplier=LCSC; ComponentLink2Description: https://datasheet.octopart.com:443/TPSM863253RDXR-Texas-Instruments-datasheet-184174687.pdf?src-supplier=LCSC; ComponentLink3URL: http://sigma.octopart.com:80/reach_statement/Texas-Instruments-company-64.pdf?src-supplier=Compliance+Statements; ComponentLink3Description: http://sigma.octopart.com:80/reach_statement/Texas-Instruments-company-64.pdf?src-supplier=Compliance+Statements; ComponentLink4URL: http://sigma.octopart.com:80/conflict_mineral_statement/Texas-Instruments-company-63.pdf?src-supplier=Compliance+Statements; ComponentLink4Description: http://sigma.octopart.com:80/conflict_mineral_statement/Texas-Instruments-company-63.pdf?src-supplier=Compliance+Statements
U5 = CMP-04910-000034-1: IC POWER MANAGEMENT

## Nets that join several sheets
+3V3: main (6 pins), mcu (15 pins), io (16 pins), power (5 pins)
+5V: main (5 pins), power (10 pins)
+12V: main (J5.1), power (10 pins)
+12V_VIN: main (J2.3), power (F1.1)
GND: main (16 pins), mcu (33 pins), io (22 pins), power (23 pins)
ACCEL_SENSOR: main (J9.1), io (R50.1)
ACCEL_SENSOR_MCU: mcu (U6.29), io (C22.1 R52.1 TP11.1)
BRAKE_SENSOR: main (J9.3), io (R54.1)
BRAKE_SENSOR_MCU: main (J6.3), mcu (U6.28), io (C49.1 R53.2 TP14.1)
BUTTON_DEADMAN: main (J7.3), io (R21.2 R23.1)
BUTTON_DEADMAN_MCU: main (J3.3), mcu (U6.33), io (C33.1 R23.2 TP16.1)
BUTTON_EMERGENCY: main (J1.1), io (R29.2 R31.1)
BUTTON_EMERGENCY_MCU: main (J3.1), mcu (U6.34), io (C37.1 R31.2 TP20.1)
BUTTON_LAP: main (J7.9), io (R34.2 R35.1)
BUTTON_LAP_MCU: mcu (U6.30), io (C39.1 R35.2 TP22.1)
BUTTON_PEDALS_CALIB: main (J1.2), io (R32.2 R33.1)
BUTTON_PEDALS_CALIB_MCU: main (J3.2), mcu (U6.41), io (C38.1 R33.2 TP21.1)
BUTTON_RADIO: main (J7.4), io (R36.2 R38.1)
BUTTON_RADIO_OUT: main (J3.7), io (C40.1 R38.2 TP23.1)
BUTTON_RESET: main (J1.4), io (R28.2 R30.1)
BUTTON_RESET_MCU: main (J3.5), mcu (U6.31), io (C36.1 R30.2 TP19.1)
BUTTON_START: main (J1.5), io (R24.2 R26.1)
BUTTON_START_MCU: main (J3.6), mcu (U6.32), io (C34.1 R26.2 TP17.1)
CAN_N: main (J2.1), io (R5.2 U1.6 U2.2)
CAN_P: main (J2.4), io (R4.2 U1.7 U2.1)
CAN_RX: mcu (U6.26), io (TP3.1 U1.4)
CAN_TX: mcu (U6.27), io (TP2.1 U1.1)
JTAG_RESET: main (J4.3), mcu (5 pins)
JTAG_SWCLK: main (J4.4), mcu (U6.38)
JTAG_SWDIO: main (J4.2), mcu (U6.37)
JTAG_SWO: main (J4.6), mcu (U6.40)
LCD_DC: main (J8.5), mcu (R49.2)
LCD_RST: main (J8.6), mcu (R48.2)
LCD_SPI_CS: main (J8.7), mcu (R47.2)
LCD_SPI_MISO: main (J8.1), mcu (R45.2)
LCD_SPI_MOSI: main (J8.4), mcu (R46.2)
LCD_SPI_SCLK: main (J8.3), mcu (R44.2)
LIGHT_BEAM: main (J7.8), io (R25.2 R27.1)
LIGHT_BEAM_MCU: main (J6.7), mcu (U6.9), io (C35.1 R27.2 TP18.1)
LIGHT_HAZARD: main (J7.1), io (R20.2 R22.1)
LIGHT_HAZARD_MCU: main (J6.1), mcu (U6.8), io (C32.1 R22.2 TP15.1)
LIGHT_LEFT_INDICATOR: main (J7.2), io (R14.2 R15.1)
LIGHT_LEFT_INDICATOR_MCU: main (J6.2), mcu (U6.12), io (C29.1 R15.2 TP10.1)
LIGHT_POSITION: main (J7.6), io (R18.2 R19.1)
LIGHT_POSITION_MCU: main (J6.5), mcu (U6.10), io (C31.1 R19.2 TP13.1)
LIGHT_RIGHT_INDICATOR: main (J7.7), io (R16.2 R17.1)
LIGHT_RIGHT_INDICATOR_MCU: main (J6.6), mcu (U6.11), io (C30.1 R17.2 TP12.1)
PA15: main (J5.2), mcu (U6.39)
RGB_LEDS: main (J10.2), mcu (U6.46)
UART_RX: main (J5.6), mcu (U6.25)
UART_TX: main (J5.4), mcu (U6.22)